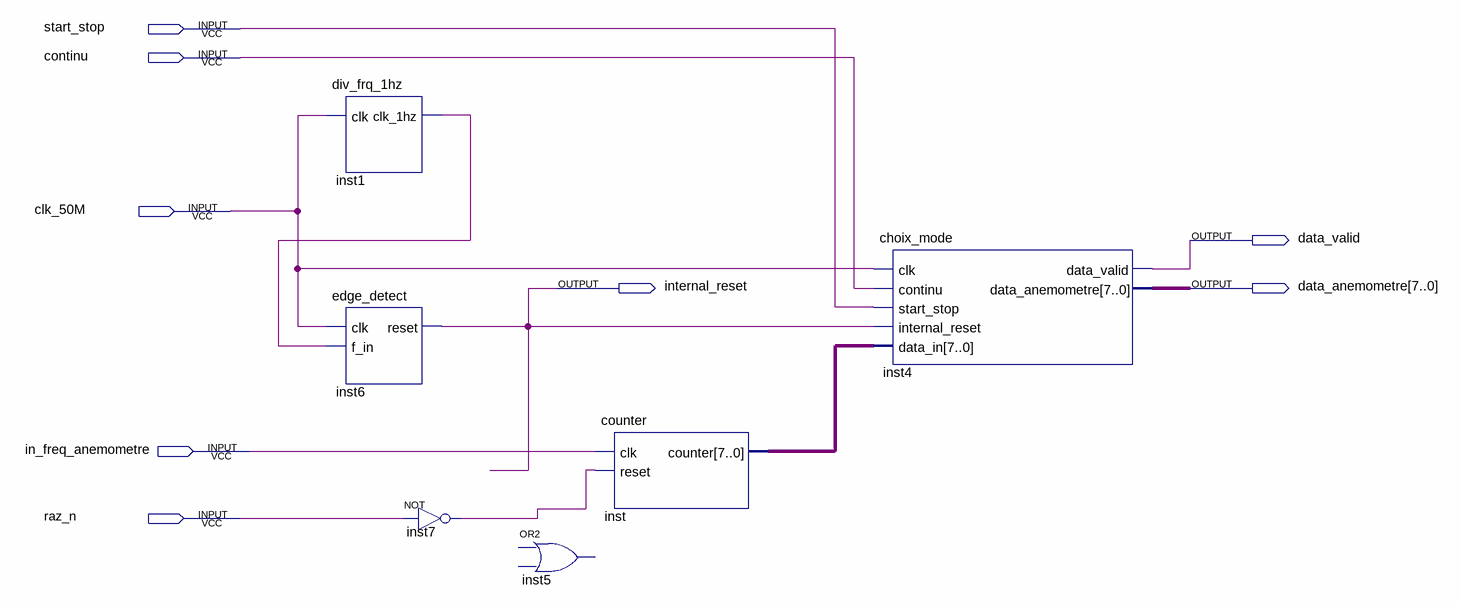
[diagram p0: schematic sheet]
// Quartus schematic gestion_anemometre.bdf as structural Verilog: 6 symbols, 8 pins
module gestion_anemometre (
  input  start_stop,
  input  continu,
  input  clk_50M,
  input  in_freq_anemometre,
  input  raz_n,
  output data_valid,
  output internal_reset,
  output [7:0] data_anemometre
);

  wire inst1_clk_1hz, inst7_out;
  wire [7:0] inst_counter;

  div_frq_1hz inst1 (.clk(clk_50M), .clk_1hz(inst1_clk_1hz));
  edge_detect inst6 (.clk(clk_50M), .f_in(inst1_clk_1hz), .reset(internal_reset));
  not inst7 (inst7_out, raz_n);
  // OR2 inst5 is placed but not wired
  counter inst (.clk(in_freq_anemometre), .reset(inst7_out), .counter(inst_counter));
  choix_mode inst4 (
    .clk(clk_50M), .continu(continu), .start_stop(start_stop), .internal_reset(internal_reset),
    .data_in(inst_counter), .data_valid(data_valid), .data_anemometre(data_anemometre));
endmodule
